# Altium schematic sheet Schematic_Bottom_Rev2.SchDoc: Bottom Board
size Letter; Address1: Mike Rankin; Address2: @mikerankin; DocumentNumber: .; Revision: 2.0; SheetNumber: 1; SheetTotal: 1
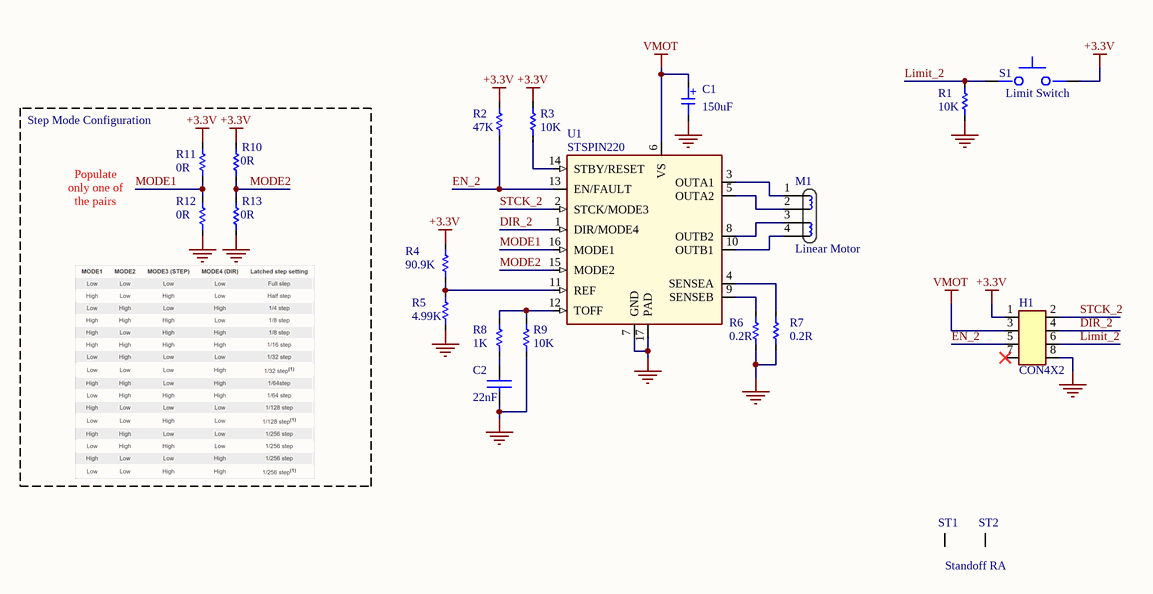
[diagram p0: Schematic_Bottom_Rev2.SchDoc]

## Parts
C1  150uF  [CAP_SM_CAN_0.250_DIA]
C2  22nF  [CAPC1005X56N]
H1  CON4X2  [RCPT2X4]
M1  Linear Motor  [Motor_Mini_Linear_1]
R1  10K  [RESC1005X40L]
R2  47K  [RESC1005X40L]
R3  10K  [RESC1005X40L]
R4  90.9K  [RESC1005X40L]
R5  4.99K  [RESC1005X40L]
R6  0.2R  [RESC1005X40L]
R7  0.2R  [RESC1005X40L]
R8  1K  [RESC1005X40L]
R9  10K  [RESC1005X40L]
R10  0R  [RESC1005X40L]  (no BOM)
R11  0R  [RESC1005X40L]  (no BOM)
R12  0R  [RESC1005X40L]
R13  0R  [RESC1005X40L]
S1  Limit Switch  [SSCQ110100]
ST1  Standoff RA  [SMTRA440-9-6ET]
ST2  Standoff RA  [SMTRA440-9-6ET]  (value not drawn)
U1  STSPIN220  [16QFN]

## Nets
+3.3V: H1.1 R2.2 R3.2 R4.2 R10.1 R11.2 S1.2(B)
GND: C1.2 C2.2 H1.8 R1.2 R5.1 R6.1 R7.1 R9.1 R12.2 R13.2 U1.7(GND) U1.17(PAD)
VMOT: C1.1 H1.3 U1.6(VS)
DIR_2: H1.4 U1.1(DIR/MODE4)
EN_2: H1.5 R2.1 U1.13(EN/FAULT)
Limit_2: H1.6 R1.1 S1.1(A)
MODE1: R11.1 R12.1 U1.16(MODE1)
MODE2: R10.2 R13.1 U1.15(MODE2)
STCK_2: H1.2 U1.2(STCK/MODE3)
NetC2_1: C2.1 R8.1
NetM1_1: M1.1 U1.3(OUTA1)
NetM1_2: M1.2 U1.5(OUTA2)
NetM1_3: M1.3 U1.8(OUTB2)
NetM1_4: M1.4 U1.10(OUTB1)
NetR3_1: R3.1 U1.14(STBY/RESET)
NetR4_1: R4.1 R5.2 U1.11(REF)
NetR6_2: R6.2 U1.9(SENSEB)
NetR7_2: R7.2 U1.4(SENSEA)
NetR8_2: R8.2 R9.2 U1.12(TOFF)

Not connected (* = marked no-connect by the designer): H1 7*; ST1 1; ST2 1

## Notes on the sheet
- (near R11) Step Mode Configuration
- only one of
- Populate
- the pairs
- Title
- Size:
- Letter
- Number:
- Revision:
- Date:
- Time:
- Sheet
- of
- (in symbol CAP_ELEC_SMT) +

## Library data of the parts
C1 = CAP_ELEC_SMT: CAP 150uF, 10V SMT; Part_Number: C242018; Manufacturer: Suncon; Part_Footprint: SMD,6.3x6mm; Vendor: LCSC; Value: 150uF
C2 = CAP_0402: CAP 22nF 16V 0402; Part_Number: C318579; Manufacturer: Samsung; Part_Footprint: 0402; Vendor: LCSC; Value: 22nF
H1 = CON4X2_F: CONN REPT 4X2 POS .100" RA; Part_Number: C92271; Manufacturer: CONNFLY; Value: Female 4X2; Vendor: LCSC; Part_Footprint: 4X2
M1 = Motor_Mini_Linear: MTR,LINEAR,SMT; Part_Number: shorturl.at/cQ269; Vendor: Aliexpress; ComponentLink1Description: Link; ComponentLink1URL: https://www.aliexpress.com/item/4000084515397.html?spm=a2g0s.9042311.0.0.27424c4d28cMfv; Value: Linear Motor
R1 R3 R9 = RES_0402: RES 10K 0402; Part_Number: C25744; Manufacturer: Uniroyal; Part_Footprint: 0402; Vendor: LCSC; Value: 10K
R2 = RES_0402: RES 47K 0402; Part_Number: C25792; Manufacturer: Uniroyal; Part_Footprint: 0402; Vendor: LCSC; Value: 47K
R4 = RES_0402: RES 90.9K 0402; Part_Number: C26989; Manufacturer: Uniroyal; Part_Footprint: 0402; Vendor: LCSC; Value: 90.9K
R5 = RES_0402: RES 4.99K 0402; Part_Number: C25903; Manufacturer: Uniroyal; Part_Footprint: 0402; Vendor: LCSC; Value: 4.99K
R6 R7 = RES_0402: RES 0.2R 0402; Part_Number: C270629; Manufacturer: Uniroyal; Part_Footprint: 0402; Vendor: LCSC; Value: 0.2R
R8 = RES_0402: RES 1K 0402; Part_Number: C11702; Manufacturer: Uniroyal; Part_Footprint: 0402; Vendor: LCSC; Value: 1K
R10-R13 = RES_0402: RES 0R 0402; Manufacturer: Uniroyal; Part_Footprint: 0402; Vendor: LCSC; Value: 0R
S1 = SSCQ110100: SWITCH DETECT, DUAL, SMD,R/A; Part_Number: C231760; Manufacturer: Alps; Vendor: LCSC; Part_Footprint: SMD; Value: Limit Switch
ST1 ST2 = SMTRA440-9-6ET: STANDOFF PCB RA 440 SMT; Manufacturer: PENN; Vendor: pemnet.com; Value: RA Mount; Part_Number: SMTRA440-9-6ET; Part_Footprint: RA
U1 = STSPIN220: IC STEPPER MOTOR DRIVER 16-VFQFPN(3x3); Manufacturer: ST Micro; Part_Footprint: 16-VFQFPM(3x3); Vendor: Digi-Key; Part_Number: STSPIN220; Value: *